# EAGLE design rpi900 (EAGLE 6.2)
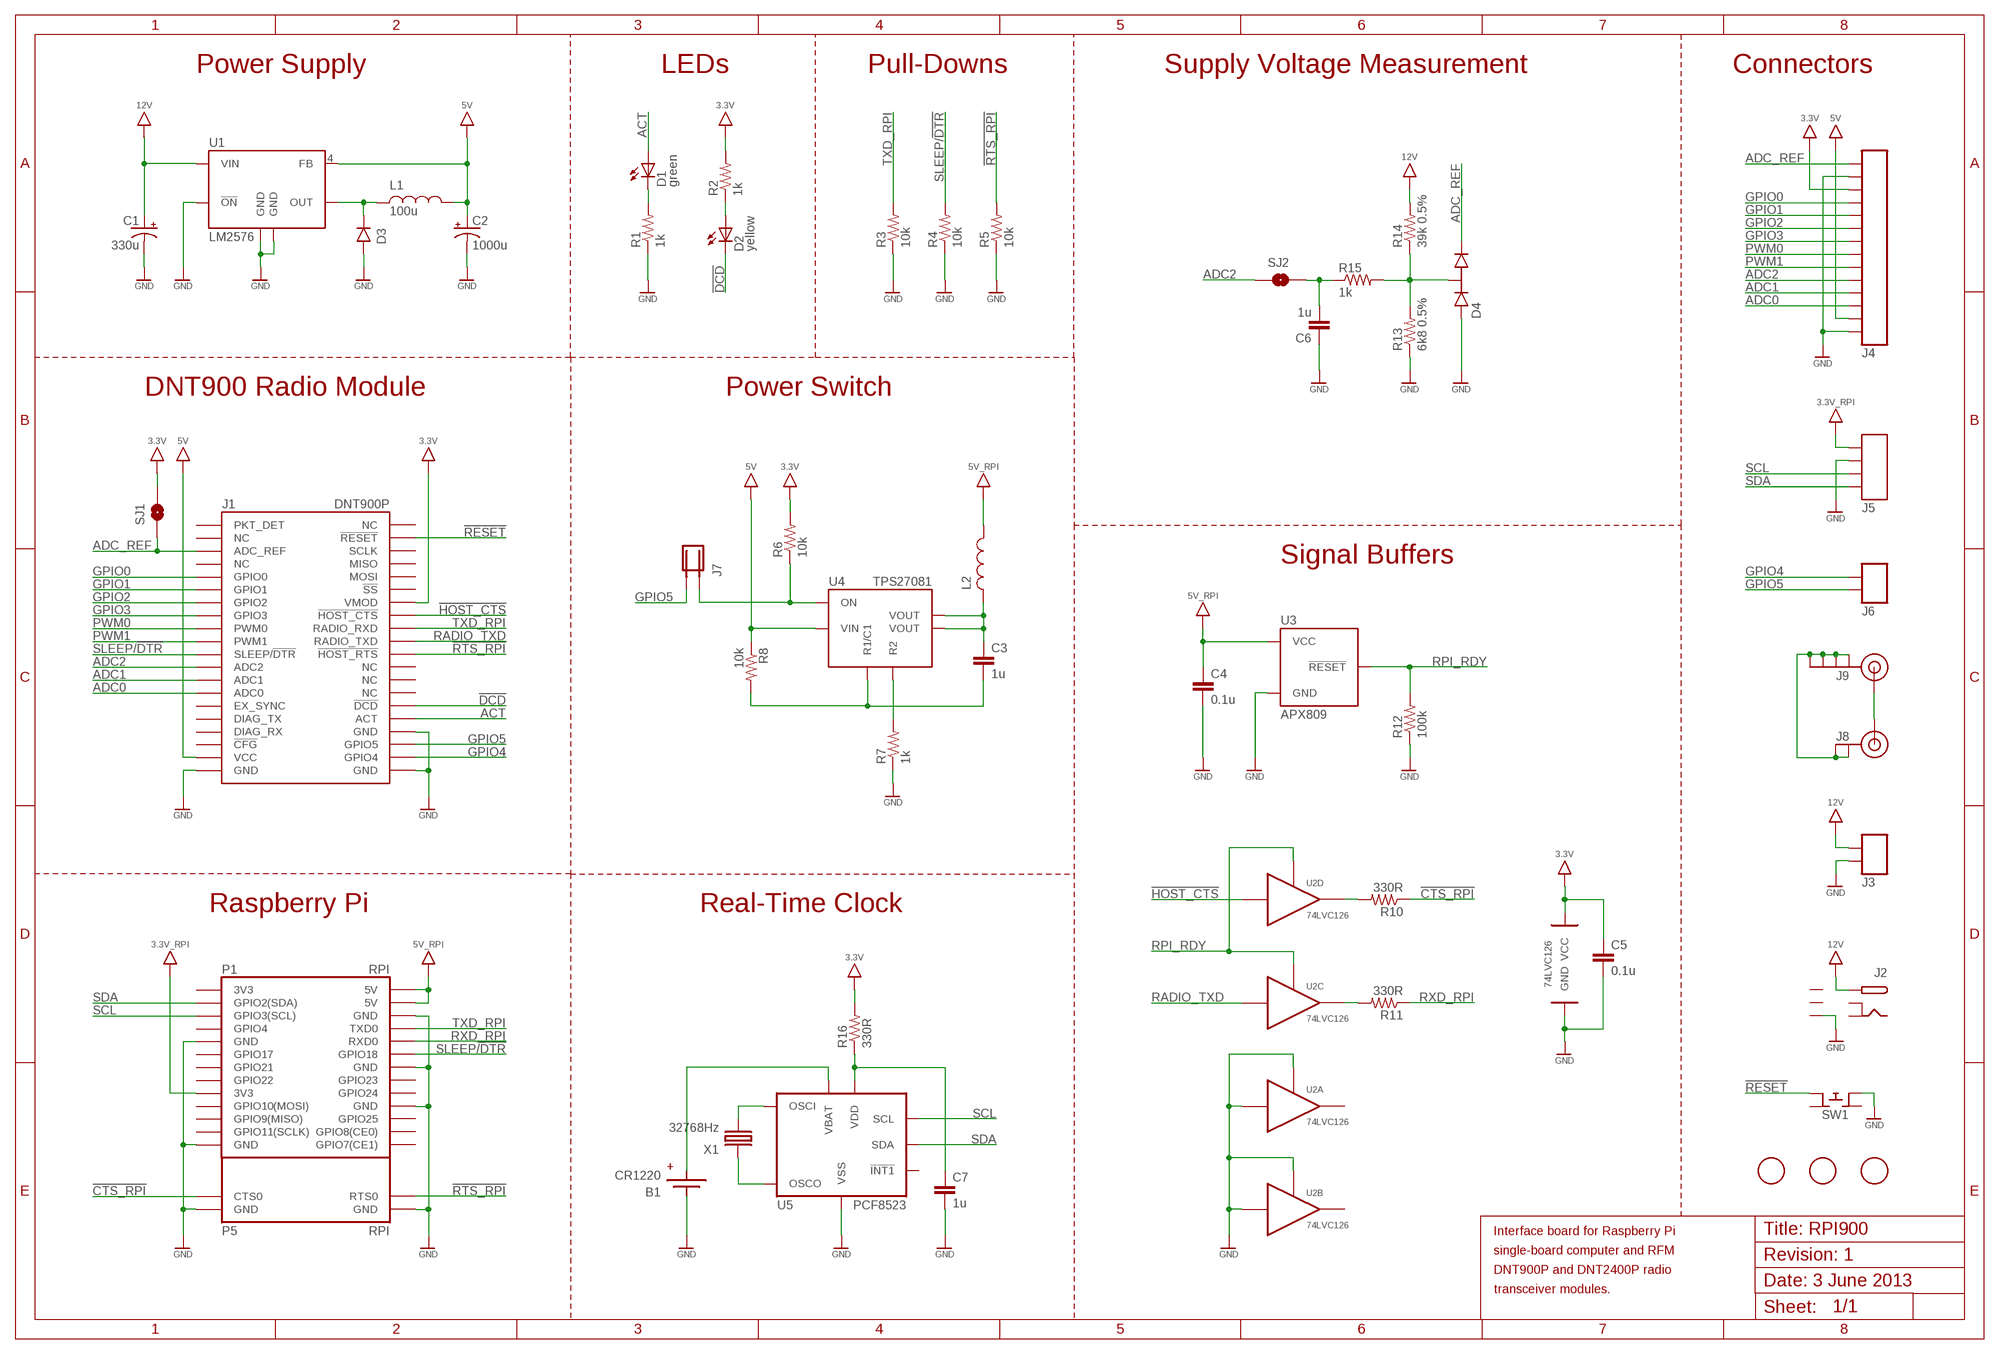
[diagram p0: schematic, sheet 1]

## Parts
B1  CR1220  CR1220SMDR  [3000]
C1  330u  CAP_POL-SMD  [140CLH-1010]
C2  1000u  CAP_POL-SMD  [140CLH-1010]
C3  1u  CAP  [0805]
C4  0.1u  CAP  [0805]
C5  0.1u  CAP  [0805]
C6  1u  CAP  [0805]
C7  1u  CAP  [0805]
D1  green  LTST-C171KGKT  [0805-LED]
D2  yellow  LTST-C171KGKT  [0805-LED]
D3  MURS320T3G  [DO-214AB]
D4  BAT54S  [SOT23]
F1  FIDUCIAL  [FIDUCIAL_1MM]
F2  FIDUCIAL  [FIDUCIAL_1MM]
F3  FIDUCIAL  [FIDUCIAL_1MM]
J1  DNT900P  [DNT900P]
J2  DCBARRELPTH  [PJ-002A]
J3  TERMINAL-2P-3.5MM  [TERMINAL-2P-3.5MM]
J4  TERMINAL-14P  [TERMINAL-14P-0.1]
J5  TERMINAL-4P  [TERMINAL-4P-0.1]
J6  TERMINAL-2P-0.1  [TERMINAL-2P-0.1]
J7  JUMPER  [JUMPER]
J8  U.FL  [U.FL]
J9  SMAPTH  [SMA-PTH]
L1  100u  SRR1280  [SRR1280]
L2  FERRITE-BEAD  [0805]
P  RPI  [RPI]
R1  1k  RESISTOR  [0805]
R2  1k  RESISTOR  [0805]
R3  10k  RESISTOR  [0805]
R4  10k  RESISTOR  [0805]
R5  10k  RESISTOR  [0805]
R6  10k  RESISTOR  [0805]
R7  1k  RESISTOR  [0805]
R8  10k  RESISTOR  [0805]
R10  330R  RESISTOR  [0805]
R11  330R  RESISTOR  [0805]
R12  100k  RESISTOR  [0805]
R13  6k8 0.5%  RESISTOR  [0805]
R14  39k 0.5%  RESISTOR  [0805]
R15  1k  RESISTOR  [0805]
R16  330R  RESISTOR  [0805]
SJ1  SOLDERJUMPERTRACE  [SJ_2S-TRACE]
SJ2  SOLDERJUMPERNO  [SJ_2S-NO]
SW1  FSM4JH  [JSM4JH]
U1  LM2576  [TO-263]
U2  74LVC126  [SO14]
U3  APX809  [SOT23]
U4  TPS27081  [TSOT-23-6]
U5  PCF8523  [SO08]
X1  32768Hz  XTAL6MM  [CFS-206]

## Nets
3.3V: C5.1 J1.P$34(VMOD) J4.3 R2.2 R6.2 R16.2 SJ1.2 U2.14(VCC)
3.3V_RPI: J5.1 P.P$17(1:3V3)
5V: C2.+ J1.P$19(VCC) J4.13 L1.P$2 R8.1 U1.4(FB) U4.P$4(VIN)
5V_RPI: C4.1 L2.2 P.P$2(1:5V) P.P$4(1:5V) U3.P$3(VCC)
12V: C1.+ J2.CENTRE J3.P$1 R14.2 U1.1(VIN)
!CTS_RPI: P.P$31(5:CTS0) R10.1
!DCD: D2.K(C) J1.P$26(!DCD)
!HOST_CTS: J1.P$33(!HOST_CTS) U2.12(D:X)
!RESET: J1.P$39(!RESET) SW1.P$3
!RTS_RPI: J1.P$30(!HOST_RTS) P.P$32(5:RTS0) R5.2
ACT: D1.A J1.P$25(ACT)
ADC0: J1.P$14(ADC0) J4.12
ADC1: J1.P$13(ADC1) J4.11
ADC2: J1.P$12(ADC2) J4.10 SJ2.1
ADC_REF: D4.P$2 J1.P$3(ADC_REF) J4.1 SJ1.1
EN_RPI: J7.1 R6.1 U4.P$5(ON)
GND: B1.NEGATIVE C1.- C2.- C4.2 C5.2 C6.1 C7.2 D3.A D4.P$1 J1.P$20(GND) J1.P$21(GND) J1.P$24(GND) J2.SLEEVE-BOTTOM J3.P$2 J4.2 J4.14 J5.2 P.P$6(1:GND) P.P$9(1:GND) P.P$14(1:GND) P.P$20(1:GND) P.P$25(1:GND) P.P$33(5:GND) P.P$34(5:GND) R1.1 R3.1 R4.1 R5.1 R7.1 R12.1 R13.1 SW1.P$1 U1.3(GND) U1.5(!ON) U1.TAB(GND) U2.1(A:!OE) U2.2(A:X) U2.4(B:!OE) U2.5(B:X) U2.7(GND) U3.P$1(GND) U5.4(VSS)
GPIO0: J1.P$5(GPIO0) J4.4
GPIO1: J1.P$6(GPIO1) J4.5
GPIO2: J1.P$7(GPIO2) J4.6
GPIO3: J1.P$8(GPIO3) J4.7
GPIO4: J1.P$22(GPIO4) J6.1
GPIO5: J1.P$23(GPIO5) J6.2 J7.2
N$1: D1.K(C) R1.2
N$2: D2.A R2.1
N$3: D4.P$3 R13.2 R14.1 R15.2
N$4: R10.2 U2.11(D:Y)
N$5: J8.P$3(SIGNAL) J9.SIG(SIGNAL)
N$6: R11.2 U2.8(C:Y)
N$7: C6.2 R15.1 SJ2.2
N$8: R7.2 U4.P$1(R2)
N$9: U5.1(OSCI) X1.P$2
N$10: J8.P$1(GND) J8.P$2(GND) J9.GND@0(GND) J9.GND@1(GND) J9.GND@2(GND) J9.GND@3(GND)
N$11: C7.1 R16.1 U5.8(VDD)
N$12: U5.2(OSCO) X1.P$1
OUT: D3.K L1.P$1 U1.2(OUT)
PWM0: J1.P$9(PWM0) J4.8
PWM1: J1.P$10(PWM1) J4.9
R1/C1: C3.2 R8.2 U4.P$6(R1/C1)
RADIO_TXD: J1.P$31(RADIO_TXD) U2.9(C:X)
RPI_RDY: R12.2 U2.10(C:!OE) U2.13(D:!OE) U3.P$2(!RESET)
RXD_RPI: P.P$10(1:RXD0) R11.1
SCL: J5.3 P.P$5(1:GPIO3(SCL)) U5.6(SCL)
SDA: J5.4 P.P$3(1:GPIO2(SDA)) U5.5(SDA)
SLEEP/!DTR: J1.P$11(SLEEP/!DTR) P.P$12(1:GPIO18) R4.2
TXD_RPI: J1.P$32(RADIO_RXD) P.P$8(1:TXD0) R3.2
VBAT: B1.POSITIVE1(POSITIVE) U5.3(VBAT)
VOUT: C3.1 L2.1 U4.P$2(VOUT) U4.P$3(VOUT)
Unconnected: J1.P$1(PKT_DET) J1.P$2(NC) J1.P$4(NC) J1.P$15(EX_SYNC) J1.P$16(DIAG_TX) J1.P$17(DIAG_RX) J1.P$18(!CFG) J1.P$27(NC) J1.P$28(NC) J1.P$29(NC) J1.P$35(!SS) J1.P$36(MOSI) J1.P$37(MISO) J1.P$38(SCLK) J1.P$40(NC) P.P$7(1:GPIO4) P.P$11(1:GPIO17) P.P$13(1:GPIO21) P.P$15(1:GPIO22) P.P$16(1:GPIO23) P.P$18(1:GPIO24) P.P$19(1:GPIO10(MOSI)) P.P$21(1:GPIO9(MISO)) P.P$22(1:GPIO25) P.P$23(1:GPIO11(SCLK)) P.P$24(1:GPIO8(CE0)) P.P$26(1:GPIO7(CE1)) SW1.P$2 SW1.P$4 U2.3(A:Y) U2.6(B:Y) U5.7(!INT1)

## Notes on the sheet
- Power Supply | LEDs | Pull-Downs | Supply Voltage Measurement | Connectors
- DNT900 Radio Module | Power Switch
- Signal Buffers
- Raspberry Pi | Real-Time Clock
- Interface board for Raspberry Pi | Title: RPI900
- single-board computer and RFM
- Revision: 1
- DNT900P and DNT2400P radio
- Date: 3 June 2013
- transceiver modules.

## Power pins joined to a net without a drawn wire
3V3: P.P$1(1:3V3)
CENTRE-BOTTOM: J2.CENTRE-BOTTOM
SHUNT: J2.SHUNT
SHUNT-BOTTOM: J2.SHUNT-BOTTOM
SLEEVE: J2.SLEEVE

## Library data of the parts
B1 = rpi900:CR1220
C1 C2 = rpi900:CAP_POL
C3-C7 = rpi900:CAP
D1 D2 = rpi900:LTST-C171KGKT
D3 = rpi900:MURS320T3G
D4 = rpi900:BAT54S
F1-F3 = rpi900:FIDUCIAL: For use by pick and place machines to calibrate the vision/machine, 1mm By microbuilder.eu
J1 = rpi900:DNT900P
J2 = rpi900:DCBARREL
J3 J6 = rpi900:TERMINAL-2P
J4 = rpi900:TERMINAL-14P
J5 = rpi900:TERMINAL-4P
J7 = rpi900:JUMPER
J8 = rpi900:U.FL: SMD antenna connector- WRL-09144
J9 = rpi900:SMA: SMA Antenna Connector End launch SMA connector. The paste layer has been removed so that the connector can be hand soldered onto the board after reflow.
L1 = rpi900:SRR1280
L2 = rpi900:FERRITE-BEAD
P = rpi900:RPI
R1-R8 R10-R16 = rpi900:RESISTOR
SJ1 SJ2 = rpi900:SOLDERJUMPER: Solder Jumper Standard SMD solder jumper. Used to automate production. Two varients : Normally Open and Normally Closed are the same, but have different paste layers. NC will have a large amount of paste and should jumper during reflow.
SW1 = rpi900:FSM4J
U1 = rpi900:LM2576
U2 = rpi900:74LVC126
U3 = rpi900:APX809
U4 = rpi900:TPS27081
U5 = rpi900:PCF8523
X1 = rpi900:XTAL

## Board
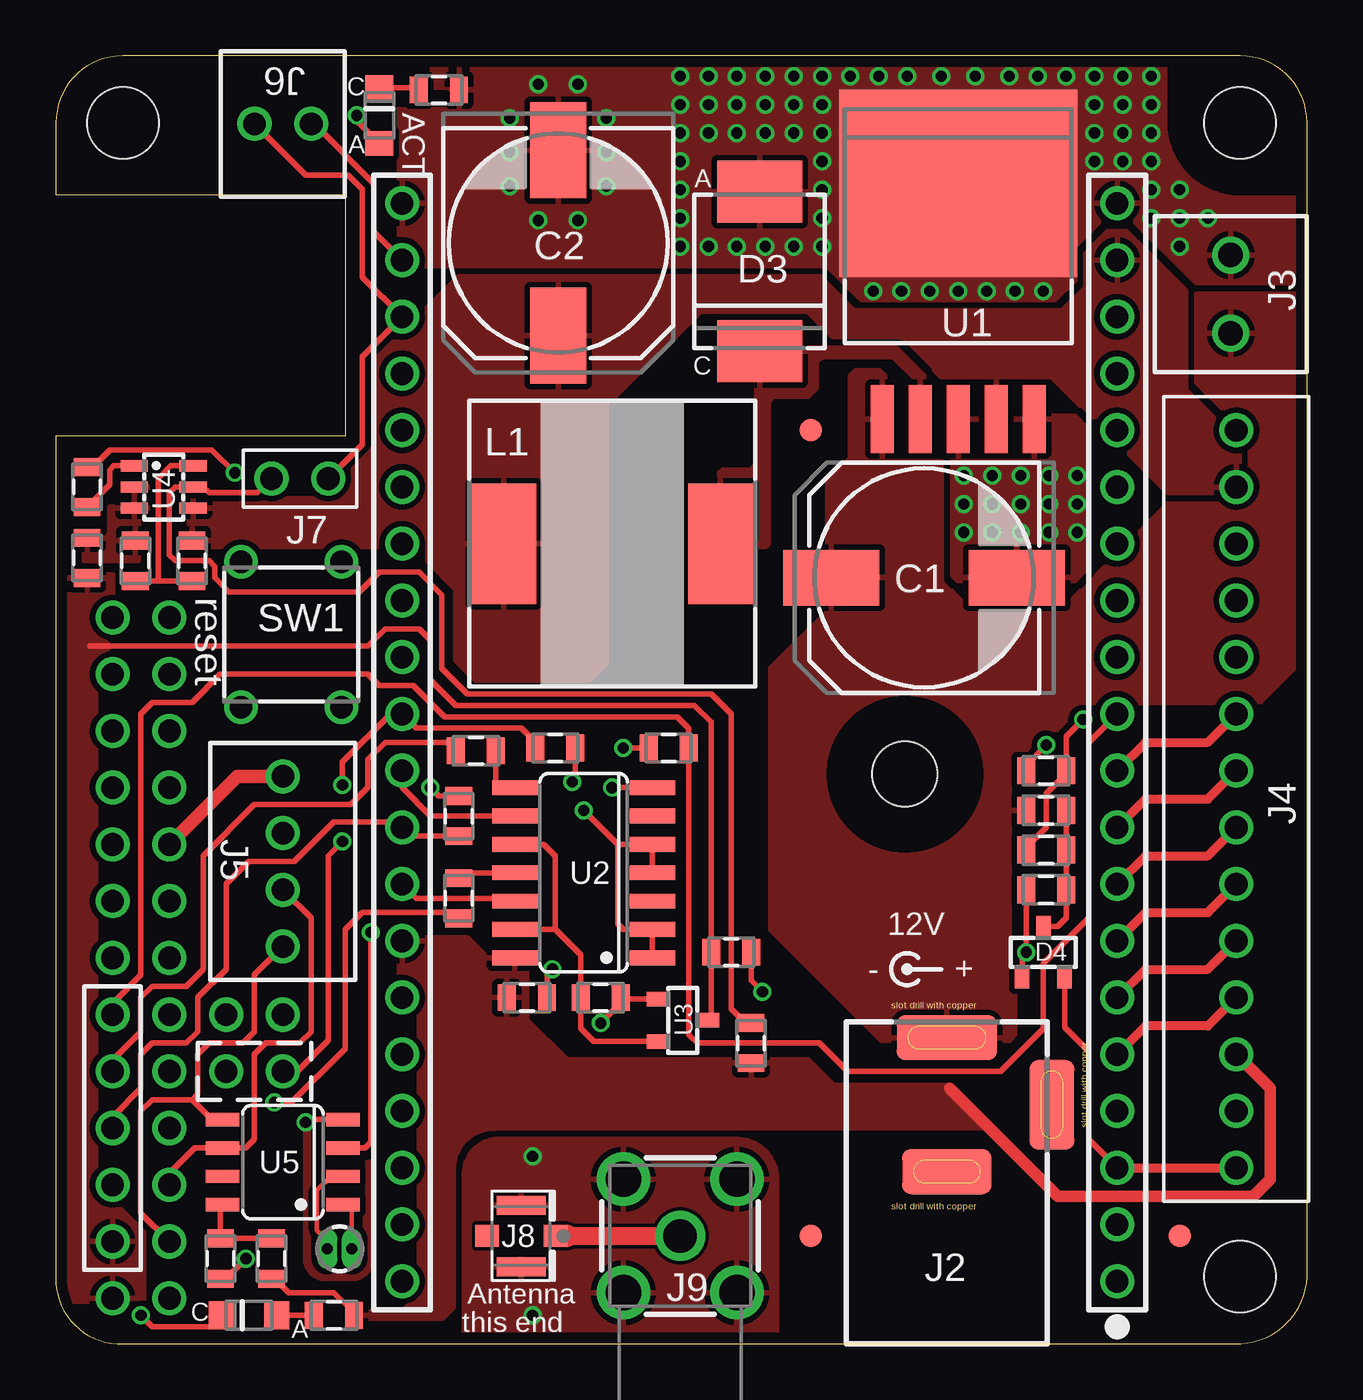
[diagram p1: board, top side]
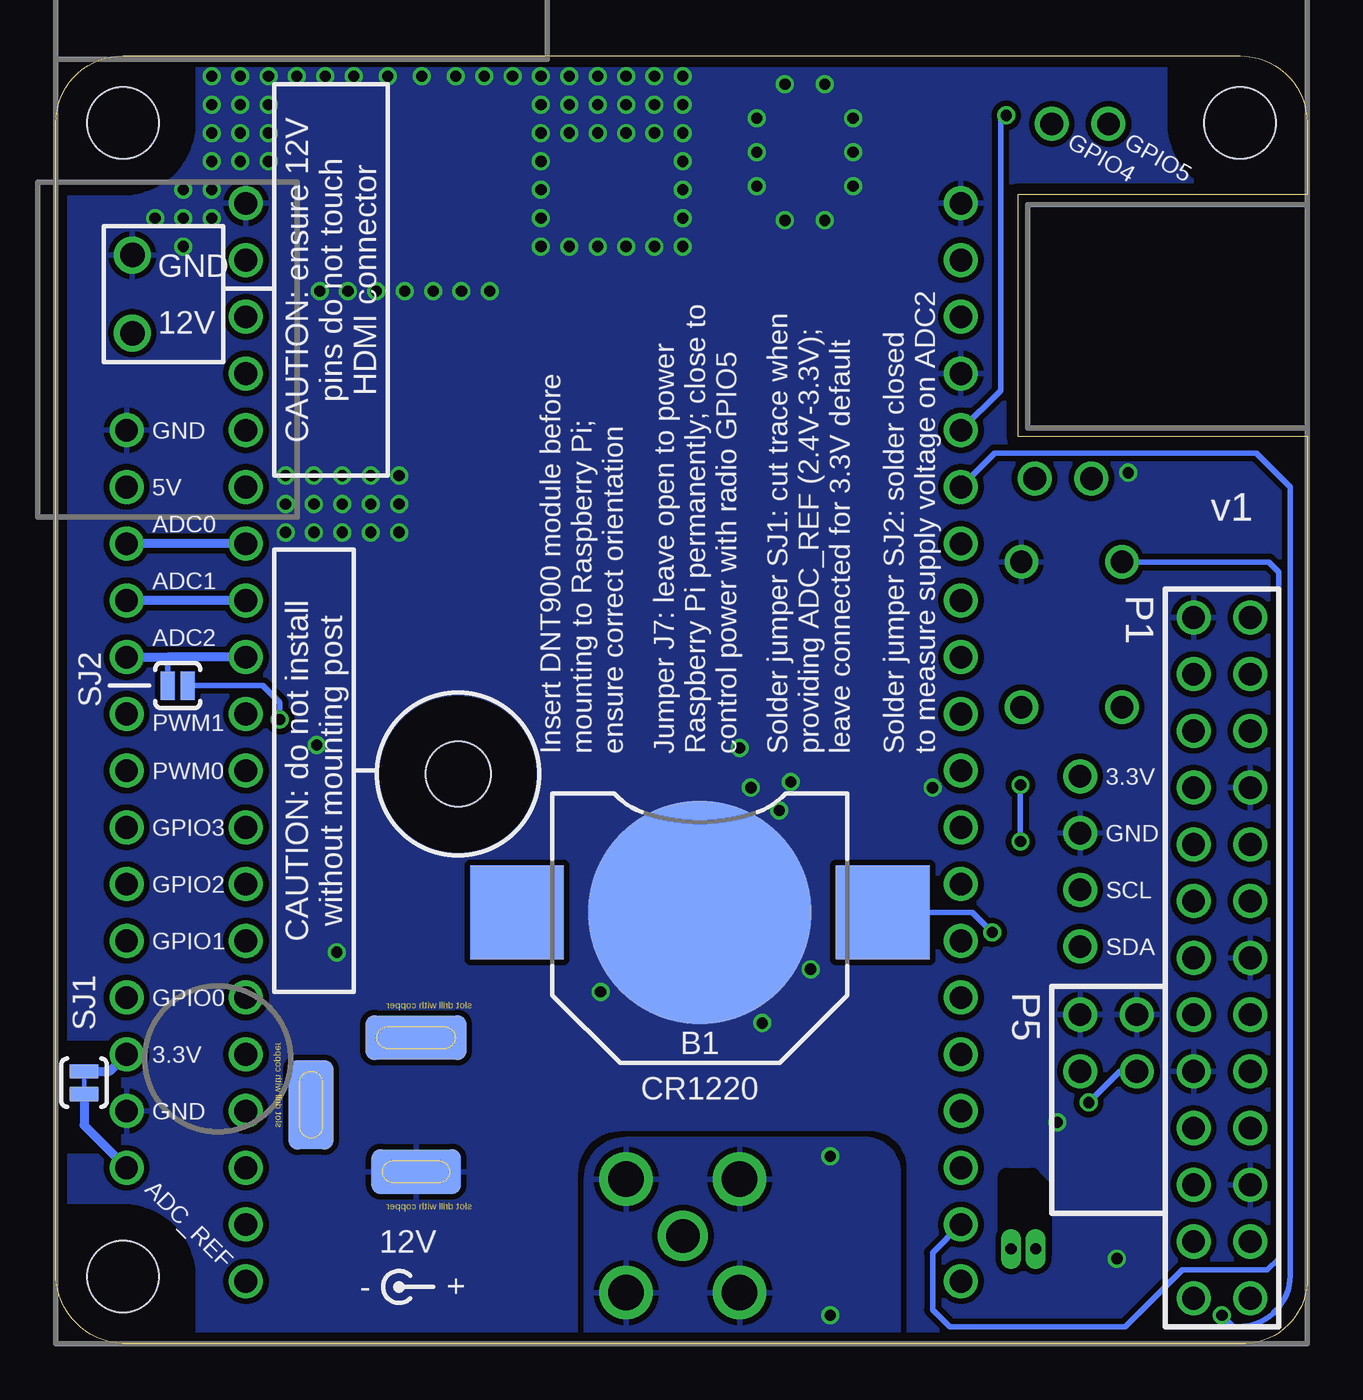
[diagram p2: board, bottom side, seen from below]

Size 56 x 57.66 mm. Coordinates in mm from the lower left corner, seen from the top.
Outline: 2.75,0 52.75,0 arc90 56,3 56,54.66 arc90 53,57.66 3,57.66 arc90 0,54.66 0,51.44 12.95,51.44 12.95,40.64 0,40.64 0,3.05 0,3 arc90 2.75,0
Copper layers (1*16): Top 0.035mm / dielectric 1.5mm / Bottom 0.035mm
Design rules: minimum track width 6mil, minimum drill 12mil, track to track 6mil, track to pad 10mil, pad to pad 8mil, via to via 10mil, smd to smd 0mil, copper to edge 20mil, drill to drill 10mil, minimum pad ring 6mil, minimum via ring 6mil, stop-mask expansion 2mil, vias tented up to drill 100mil, thermal gap 10mil
tRestrict: 6 lines
bRestrict: area 11.8,3.9 to 13.5,7.5; 6 lines

### Footprints (pad centres in the part's own frame; a part is rotated, then mirrored left to right if it is on the bottom)
3000 = smd 10 x 10: NEGATIVE 0,0 | smd 4.2 x 4.2: POSITIVE1 8.185,0; POSITIVE2 -8.185,0
140CLH-1010 = smd 4.3 x 2.5: + -4.15,0; - 4.15,0
0805 = smd 0.8 x 1.2: 1 -0.9,0; 2 0.9,0
0805-LED = smd 1.1 x 1.25: A 1.25,0; K -1.25,0
DO-214AB = smd 2.794 x 3.81: A 3.569,0; K -3.569,0
SOT23 = smd 0.95 x 0.65: P$1 -1.15,0.95; P$2 -1.15,-0.95; P$3 1.15,0
FIDUCIAL_1MM = smd 1 x 1: 1 0,0
DNT900P = drill 1.016: P$1 0,0; P$2 0,-2.54; P$3 0,-5.08; P$4 0,-7.62; P$5 0,-10.16; P$6 0,-12.7; P$7 0,-15.24; P$8 0,-17.78; P$9 0,-20.32; P$10 0,-22.86; P$11 0,-25.4; P$12 0,-27.94; P$13 0,-30.48; P$14 0,-33.02; P$15 0,-35.56; P$16 0,-38.1; P$17 0,-40.64; P$18 0,-43.18; P$19 0,-45.72; P$20 0,-48.26; P$21 32.004,-48.26; P$22 32.004,-45.72; P$23 32.004,-43.18; P$24 32.004,-40.64; P$25 32.004,-38.1; P$26 32.004,-35.56; P$27 32.004,-33.02; P$28 32.004,-30.48; P$29 32.004,-27.94; P$30 32.004,-25.4; P$31 32.004,-22.86; P$32 32.004,-20.32; P$33 32.004,-17.78; P$34 32.004,-15.24; P$35 32.004,-12.7; P$36 32.004,-10.16; P$37 32.004,-7.62; P$38 32.004,-5.08; P$39 32.004,-2.54; P$40 32.004,0
PJ-002A = smd 4.5 x 2: CENTRE 0,13.7 | smd 4.5 x 2 bottom: CENTRE-BOTTOM 0,13.7 | smd 2 x 4: SHUNT 4.7,10.7 | smd 2 x 4 bottom: SHUNT-BOTTOM 4.7,10.7 | smd 4 x 2: SLEEVE 0,7.7 | smd 4 x 2 bottom: SLEEVE-BOTTOM 0,7.7
TERMINAL-2P-3.5MM = drill 1.1: P$1 1.75,0; P$2 -1.75,0
TERMINAL-14P-0.1 = drill 1.016: 1 0,0; 2 2.54,0; 3 5.08,0; 4 7.62,0; 5 10.16,0; 6 12.7,0; 7 15.24,0; 8 17.78,0; 9 20.32,0; 10 22.86,0; 11 25.4,0; 12 27.94,0; 13 30.48,0; 14 33.02,0
TERMINAL-4P-0.1 = drill 1.016: 1 0,0; 2 2.54,0; 3 5.08,0; 4 7.62,0
TERMINAL-2P-0.1 = drill 1.016: 1 0,0; 2 2.54,0
JUMPER = drill 1.016: 1 0,0; 2 2.54,0
U.FL = smd 2.2 x 0.85: P$1 0,1.375; P$2 0,-1.375 | smd 1.05 x 1: P$3 1.525,0; P$4 -1.525,0
SMA-PTH = drill 1.6: GND@0 -2.54,2.54; GND@1 2.54,2.54; GND@2 2.54,-2.54; GND@3 -2.54,-2.54 | drill 1.5: SIG 0,0
SRR1280 = smd 2.9 x 5.4: P$1 -4.85,0; P$2 4.85,0
RPI = drill 1.016: P$1 5.08,2.032; P$2 2.54,2.032; P$3 5.08,4.572; P$4 2.54,4.572; P$5 5.08,7.112; P$6 2.54,7.112; P$7 5.08,9.652; P$8 2.54,9.652; P$9 5.08,12.192; P$10 2.54,12.192; P$11 5.08,14.732; P$12 2.54,14.732; P$13 5.08,17.272; P$14 2.54,17.272; P$15 5.08,19.812; P$16 2.54,19.812; P$17 5.08,22.352; P$18 2.54,22.352; P$19 5.08,24.892; P$20 2.54,24.892; P$21 5.08,27.432; P$22 2.54,27.432; P$23 5.08,29.972; P$24 2.54,29.972; P$25 5.08,32.512; P$26 2.54,32.512; P$31 7.62,12.192; P$32 10.16,12.192; P$33 7.62,14.732; P$34 10.16,14.732 | hole 2.9: 38,25.5
SJ_2S-TRACE = smd 0.635 x 1.27: 1 -0.508,0; 2 0.508,0
SJ_2S-NO = smd 0.635 x 1.27: 1 -0.45,0; 2 0.45,0
JSM4JH = drill 1: P$1 -3.25,2.25; P$2 3.25,2.25; P$3 -3.25,-2.25; P$4 3.25,-2.25
TO-263 = smd 3.048 x 1.016: 1 -8.636,3.404; 2 -8.636,1.702; 3 -8.636,0; 4 -8.636,-1.702; 5 -8.636,-3.404 | smd 8.382 x 10.668: TAB 1.905,0
SO14 = smd 2.032 x 0.66: 1 -3.073,3.81; 2 -3.073,2.54; 3 -3.073,1.27; 4 -3.073,0; 5 -3.073,-1.27; 6 -3.073,-2.54; 7 -3.073,-3.81; 8 3.073,-3.81; 9 3.073,-2.54; 10 3.073,-1.27; 11 3.073,0; 12 3.073,1.27; 13 3.073,2.54; 14 3.073,3.81
TSOT-23-6 = smd 1.22 x 0.5: P$1 -1.315,0.95; P$2 -1.315,0; P$3 -1.315,-0.95; P$4 1.315,-0.95; P$5 1.315,0; P$6 1.315,0.95
SO08 = smd 1.5 x 0.6: 1 -2.7,1.905; 2 -2.7,0.635; 3 -2.7,-0.635; 4 -2.7,-1.905; 5 2.7,-1.905; 6 2.7,-0.635; 7 2.7,0.635; 8 2.7,1.905
CORNER-SHARP = hole 3.2: 3,3
CFS-206 = drill 0.5 pad 0.897 long: P$1 -0.55,0; P$2 0.55,0

### Placement (x,y rotation side)
B1  27.18,19.3 0 bottom
C1  38.86,34.29 0 top
C2  22.48,49.28 90 top
C3  3.56,35.05 270 top
C4  30.23,17.53 0 top
C5  21.08,15.49 0 top
C6  44.32,25.65 0 top
C7  7.37,3.81 270 top
D1  14.48,54.99 270 top
D2  8.64,1.27 0 top
D3  31.5,48.01 90 top
D4  44.2,17.53 90 top
F1  33.78,4.83 0 top
F2  50.29,4.83 0 top
F3  33.78,40.89 0 top
J1  47.5,2.79 180 top
J2  39.88,0 0 top
J3  52.58,46.99 270 top
J4  52.83,7.87 90 top
J5  10.16,25.4 270 top
J6  11.43,54.61 180 top
J7  9.65,38.73 0 top
J8  20.83,4.83 0 top
J9  27.94,4.83 180 top
L1  24.89,35.81 180 top
L2  1.4,35.18 270 top
P  0,0 0 top
R1  17.14,56.13 180 top
R2  12.45,1.27 0 top
R3  18.03,23.62 270 top
R4  27.43,26.67 0 top
R5  22.35,26.67 180 top
R6  31.11,13.46 270 top
R7  1.4,38.35 270 top
R8  6.1,35.05 270 top
R10  18.03,19.94 90 top
R11  18.8,26.54 0 top
R12  24.38,15.49 180 top
R13  44.32,20.32 0 top
R14  44.32,23.88 180 top
R15  44.32,22.1 0 top
R16  9.65,3.81 270 top
SJ1  54.74,11.68 90 bottom
SJ2  50.55,29.46 0 bottom
SW1  10.54,31.75 270 top
U1  40.39,50.04 90 top
U2  23.62,21.08 180 top
U3  28.07,14.48 0 top
U4  4.83,38.35 0 top
U5  10.16,8.13 180 top
U$9  [CORNER-SHARP]  0,57.66 270 top
U$28  [CORNER-SHARP]  56,57.66 180 top
U$46  [CORNER-SHARP]  56,0 90 top
X1  12.7,4.24 0 top

### Tracks (layer width: path | path; a pad name or v marks a point on that pad's centre or on a via)
3.3V
  Top 0.254: R2.2 13.35,1.39 12.45,2.29 10.41,2.29 9.79,2.91 R16.2
  Top 0.508: J4.3 54.36,11.43 54.36,7.37 53.59,6.6 46.23,6.6 44.83,6.6 40.01,11.43
  Bottom 0.406: SJ1.2 53.59,12.19 J4.3
  pour Top (isolate 0.254, rank 3): 19.81,9.65 41.91,9.65 40.01,11.56 34.8,11.56 33.66,12.7 22.86,12.7 21.08,14.48 21.08,17.4 19.18,17.4 18.41,18.16 15.37,18.16 15.37,15.88 16.26,14.99 16.26,2.16 16.26,2.16 15.49,1.4 13.21,1.4 13.21,1.14 17.27,1.14 17.78,1.65 17.78,7.62 arc-90
3.3V_RPI
  Top 0.61: P.P$17 8.13,25.4 J5.1
5V
  pour Top (isolate 0.254, rank 4): 12.95,42.67 12.95,37.85 5.97,37.85 5.97,35.69 16.64,35.69 16.64,35.05 17.91,33.78 17.91,30.61 18.8,29.72 23.88,29.72 24.64,30.48 24.64,42.04 28.83,46.23 33.66,46.23 34.8,45.09 37.85,45.09 39.62,43.31 41.91,43.31 41.91,42.42 42.42,42.42 42.42,43.31 44.58,43.31 49.78,38.1 52.96,38.1 52.96,49.78 20.07,49.78
5V_RPI
  Top 0.254: 1.52,31.24 13.97,31.24 14.73,32 16.26,32 16.76,31.5 16.76,29.72 17.91,28.57 28.57,28.57 29.33,27.82 C4.1 29.33,14.48 U3.P$3
  pour Top (isolate 0.254, rank 4): 0,1.91 0,34.42 2.54,34.42 2.54,33.53 1.78,32.77 1.78,31.88 2.41,31.24 1.78,30.61 1.78,7.11 3.94,4.95 3.94,1.91
  pour Top (isolate 0.254): 2.54,34.42 2.54,33.4 0.64,33.4 0.64,34.42
12V
  pour Top (isolate 0.254, rank 3): 36.96,13.59 32,18.54 32,30.23 34.54,32.77 34.54,38.61 35.56,39.62 35.56,43.31 35.81,43.56 36.83,43.56 37.21,43.18 37.21,39.62 39.62,39.62 39.62,34.16 40.64,33.15 45.34,33.15 49.78,37.59 53.47,37.59 53.47,40.64 51.05,43.05 51.05,46.99 56.13,46.99 56.13,30.99 53.85,28.7 45.97,28.7 42.67,25.4 42.67,24.13 43.43,24.13 43.43,23.62 42.67,23.62 42.67,15.75 42.93,15.75 42.93,13.84 42.67,13.59
!CTS_RPI  (via drill 0.5)
  Top 0.254: R10.1 17.77,19.3 13.72,19.3 12.95,18.54 12.95,13.21 10.54,10.79 v9.78,10.79
  Bottom 0.254: v9.78,10.79 8.38,12.19 P.P$31
!DCD  (via drill 0.5)
  Top 0.254: v3.81,1.27 4.32,0.76 7.39,0.76 D2.K 7.37,1.27
  Bottom 0.254: J1.P$26 13.97,39.88 2.29,39.88 0.76,38.35 0.76,3.05 arc90 3.05,0.76 3.3,0.76 v3.81,1.27
!HOST_CTS
  Top 0.254: U2.12 20.42,19.94 16.13,19.94 J1.P$33
!RESET
  Bottom 0.254: J1.P$39 16.76,4.06 16.76,1.52 16,0.76 8.13,0.76 5.59,3.3 1.78,3.3 1.27,3.81 1.27,34.54 1.73,35 SW1.P$3
!RTS_RPI  (via drill 0.5)
  Top 0.254: R5.2 21.45,26.93 20.83,27.56 16.13,27.56 J1.P$30 14.99,28.19 12.83,26.04 v12.83,25.02 | P.P$32 10.79,12.19 12.19,13.59 12.19,21.84 v12.83,22.48
  Bottom 0.254: v12.83,25.02 v12.83,22.48
ACT  (via drill 0.5)
  Top 0.254: D1.A 13.46,54.76 v13.46,54.99
  Bottom 0.254: J1.P$25 13.72,42.67 13.72,54.74 v13.46,54.99
ADC0
  Bottom 0.406: J1.P$14 J4.12
ADC1
  Bottom 0.406: J1.P$13 J4.11
ADC2
  Bottom 0.254: SJ2.1 51,30.73
  Bottom 0.406: J1.P$12 51,30.73 J4.10
ADC_REF
  Top 0.254: D4.P$2 45.15,14.16 46.23,13.08 46.23,9.14 J1.P$3
  Top 0.406: J1.P$3 J4.1
  Bottom 0.406: SJ1.1 54.74,9.78 J4.1
EN_RPI
  Top 0.254: J7.1 9.02,38.1 6.86,38.1 6.6,38.35 U4.P$5 5.33,38.35 5.08,38.1 5.08,35.31 5.33,35.05 6.86,35.05 7.11,34.8 7.11,34.29 7.75,33.66 13.59,33.66 14.48,34.54 16.26,34.54 17.27,33.53 17.27,30.23 18.41,29.08 29.34,29.08 30.23,28.19 30.23,14.99 30.85,14.36 R6.1
GND  (via drill 0.5)
  Top 0.254: U2.4 U2.5 25.15,22.35 | U2.1 U2.2 25.4,18.54 25.15,18.8 25.15,22.35 | R7.1 1.66,39.25 2.41,40.01 6.99,40.01 v8,38.99 | C5.2 21.98,16.52 v22.23,16.76 | U2.7 v24.89,24.89 | C4.2 31.11,17.52 31.11,16.26 v31.62,15.75 | R12.1 | U3.P$1 25.35,15.43 R12.1 | R5.1 23.25,25.28 v23.11,25.15 | R4.1 v25.4,26.67 | R3.1 17.13,24.52 v16.76,24.89 | 25.15,22.35 v23.62,23.88 | R12.1 25.28,15.25 v24.38,14.35 | U5.4 11.3,10.03 v11.18,9.91 | D4.P$1 43.25,17.34 v43.43,17.53 v43.42,17.54 R13.1 | C6.1 43.42,25.9 v44.32,26.8 | C7.2 7.61,2.91 v8.51,3.81
  other vias: 40.64,38.86 40.64,37.59 41.91,37.59 43.18,37.59 44.45,37.59 43.18,38.86 41.91,38.86 50.29,49.12 50.29,50.39 49.02,50.39 49.02,51.66 50.29,51.66 49.02,52.93 47.75,52.93 46.48,52.93 46.48,54.2 47.75,54.2 49.02,54.2 49.02,55.47 49.02,56.74 47.75,56.74 47.75,55.47 46.48,55.47 46.48,56.74 45.21,56.74 43.94,56.74 42.67,56.74 41.15,56.74 39.62,56.74 38.1,56.74 36.83,56.74 35.56,56.74 34.29,49.12 34.29,50.39 34.29,51.66 34.29,52.93 34.29,54.2 34.29,55.47 34.29,56.74 33.02,56.74 33.02,55.47 33.02,54.2 31.75,54.2 30.48,54.2 29.21,54.2 29.21,55.47 29.21,56.74 30.48,56.74 31.75,56.74 31.75,55.47 30.48,55.47 20.32,54.86 24.64,54.86 24.64,53.34 24.64,51.82 20.32,53.34 20.32,51.82 33.02,49.12 31.75,49.12 30.48,49.12 29.21,49.12 23.37,50.29 21.59,50.29 51.56,50.39 27.94,54.2 27.94,52.93 27.94,51.66 27.94,50.39 27.94,49.12 36.58,47.12 37.85,47.12 40.64,36.32 41.91,36.32 43.18,36.32 44.45,36.32 45.72,36.32 23.37,56.39 21.59,56.39 27.94,55.47 27.94,56.74 39.12,47.12 40.39,47.12 41.66,47.12 42.93,47.12 44.2,47.12 44.45,38.86 45.72,37.59 45.72,38.86
  pour Bottom (isolate 0.254, rank 6): 0,0 0,57.66 56.13,57.66 56.13,0
  pour Top (isolate 0.254, rank 2): 40.13,41.53 45.59,41.53 46.1,41.02 46.1,34.67 45.59,34.16 40.39,34.16 40.13,34.42
  pour Top (isolate 0.254, rank 2): 56.13,47.5 56.13,57.66 12.95,57.66 12.95,48.26 34.54,48.26 36.07,46.74 44.7,46.74 45.59,47.62 45.59,49.15 46.99,50.55 48.01,50.55 51.05,47.5
  pour Top (isolate 0.254): 11.3,9.91 11.3,3.81 13.84,3.81 13.84,6.1 13.97,6.1 13.97,8.13 14.1,8.13 14.1,3.81 arc-90 13.34,2.92 12.06,2.92 arc-90 11.18,3.81 11.18,9.91
GPIO0
  Top 0.406: J1.P$5 48.77,14.22 51.56,14.22 J4.4
GPIO1
  Top 0.406: J4.5 51.56,16.76 48.77,16.76 J1.P$6
GPIO2
  Top 0.406: J4.6 51.56,19.3 48.77,19.3 J1.P$7
GPIO3
  Top 0.406: J4.7 51.56,21.84 48.77,21.84 J1.P$8
GPIO4
  Top 0.254: J1.P$22 14.22,49.78 14.22,51.94 11.56,54.61 J6.1
GPIO5
  Top 0.254: J6.2 11.18,52.32 13.08,52.32 13.72,51.69 13.72,47.75 J1.P$23 13.72,44.2 13.72,40.26 J7.2
N$1
  Top 0.254: D1.K 16.14,56.24 R1.2
N$2
  Top 0.254: D2.A R2.1
N$3
  Top 0.254: R14.1 R15.2 R13.2 45.22,19.06 45.21,19.05 44.84,18.68 D4.P$3
N$4
  Top 0.254: R10.2 18.28,21.08 U2.11
N$5
  Top 0.813: 22.86,4.83 J9.SIG
  Top 1.001: J8.P$3 22.86,4.83
N$6
  Top 0.254: U2.8 19.7,24.89 R11.2
N$7  (via drill 0.5)
  Top 0.254: v45.97,27.94 45.22,27.19 C6.2 45.22,25.54 44.32,24.64 44.32,23.11 43.42,22.21 R15.1
  Bottom 0.254: v45.97,27.94 45.97,28.7 46.74,29.46 SJ2.2
N$8
  Top 0.254: U4.P$1 2.6,39.3 2.41,39.12 2.41,38.47 R7.2
N$9
  Top 0.203: U5.1 13.25,6.22 X1.P$2
N$10  (via drill 0.5)
  other vias: 21.34,1.27 21.34,8.38
  pour Top (isolate 0.152): 18.29,0 18.29,7.62 arc-90 19.81,9.14 30.48,9.14 arc-90 32.26,7.37 32.26,0
  pour Bottom (isolate 0.254): 18.29,0 18.29,7.62 arc-90 19.81,9.14 30.48,9.14 arc-90 32.26,7.37 32.26,0
N$11
  Top 0.254: R16.1 C7.1 7.37,6.22 U5.8
N$12
  Top 0.203: U5.2 12.32,7.49 11.68,6.86 11.68,5.08 12.15,4.61 X1.P$1
OUT
  pour Top (isolate 0.254, rank 2): 31.75,35.69 31.88,35.81 31.88,42.16 32.13,42.42 33.66,42.42 34.04,42.8 34.04,43.94 34.29,44.2 37.47,44.2 38.48,43.18 38.48,42.42 38.86,42.42 38.86,43.31 37.59,44.58 31.37,44.58 31.37,39.37 31.11,39.12 29.84,39.12 29.72,38.99 29.72,35.69
PWM0
  Top 0.406: J4.8 51.56,24.38 48.77,24.38 J1.P$9
PWM1
  Top 0.406: J4.9 51.56,26.92 48.77,26.92 J1.P$10
R1/C1
  Top 0.254: U4.P$6 5.14,39.3 4.57,38.73 | 3.57,34.16 C3.2 4.57,34.15 | 4.57,38.73 4.57,34.15 | 4.57,34.15 R8.2 | 4.57,38.73 4.57,34.15
RADIO_TXD
  Top 0.254: U2.9 16.76,23.62 15.49,24.89 J1.P$31
RPI_RDY
  Top 0.254: U2.10 21.84,22.35 22.35,21.84 22.35,18.54 | U2.13 22.35,18.54 | 22.35,18.54 23.48,17.41 R12.2 23.48,14.11 24.06,13.53 U3.P$2
RXD_RPI
  Top 0.254: P.P$10 2.54,12.7 3.81,13.97 3.81,15.49 4.32,16 5.84,16 6.6,16.76 6.6,21.84 8.89,24.13 13.21,24.13 13.97,24.89 13.97,26.16 14.73,26.92 17.9,26.92 R11.1
SCL
  Top 0.254: J5.3 11.43,19.05 11.43,13.97 10.92,13.46 9.4,13.46 8.89,12.95 8.89,9.14 8.51,8.76 U5.6 6.22,8.76 5.08,7.62 P.P$5
SDA
  Top 0.254: P.P$3 3.81,5.84 3.81,8.38 3.81,10.41 4.32,10.92 6.1,10.92 | 6.1,10.92 6.35,11.18 6.35,12.95 6.86,13.46 8.38,13.46 8.89,13.97 8.89,16.51 J5.4 | U5.5 6.99,10.03 6.1,10.92
SLEEP/!DTR
  Top 0.254: J1.P$11 46.23,26.92 46.23,19.05 44.2,17.02 44.2,14.1 42.29,12.19 35.43,12.19 34.16,13.46 28.7,13.46 28.33,13.83 R4.2 28.33,27.55 27.81,28.07 17.4,28.07 16,29.46 14.48,29.46 13.97,29.97 7.37,29.97 6.1,28.7 4.32,28.7 3.81,28.19 3.81,16.51 2.54,15.24 P.P$12
TXD_RPI
  Top 0.254: R3.2 15.89,22.72 J1.P$32 15.24,23.37 12.45,23.37 10.67,21.59 8.64,21.59 7.62,20.57 7.62,16.76 6.35,15.49 6.35,13.97 5.84,13.46 4.32,13.46 3.81,12.95 3.81,11.43 2.54,10.16 P.P$8
VBAT  (via drill 0.5)
  Top 0.254: U5.3 13.84,8.76 14.1,9.02 v14.1,18.41
  Bottom 0.254: B1.POSITIVE1 14.99,19.3 v14.1,18.41
VOUT
  pour Top (isolate 0.254, rank 3): 1.27,35.05 1.27,36.2 2.41,36.2 2.41,37.47 3.05,37.47 3.05,38.35 4.57,38.35 4.57,37.34 3.68,37.34 3.68,35.05

### Text on the board
tPlace: C | ACT | A | A | C | reset | 12V | - | + | Antenna | C | this end | A
bPlace: GPIO5 | GPIO4 | HDMI connector | pins do not touch | CAUTION: ensure 12V | GND | 12V | GND | 5V | v1 | ADC0 | P1 | ADC1 | ADC2 | PWM1 | to measure supply voltage on ADC2 | Solder jumper SJ2: solder closed | leave connected for 3.3V default | providing ADC_REF (2.4V-3.3V); | Solder jumper SJ1: cut trace when | control power with radio GPIO5 | Raspberry Pi permanently; close to | Jumper J7: leave open to power | ensure correct orientation | mounting to Raspberry Pi; | Insert DNT900 module before | without mounting post | CAUTION: do not install | 3.3V | PWM0 | GPIO3 | GND | SCL | GPIO2 | GPIO1 | SDA | P5 | GPIO0 | 3.3V | GND | ADC_REF | 12V | + | -
tDocu: Headers J1A and J1B support daughter card; | components between headers are height-limited | to less than 11mm. | SMA connector J9 projects over edge of PCB. | Connectors J3, J4, J5 and J6 are not installed. | No assembly on bottom of board (bottom headers | P1 and P5 and battery B1 are not installed). | Peelable solder mask protects bottom pads of | P1, P5, J3, J4, J5, J6 and B1. | Position of pin 1 on ICs indicated with a dot. | Diode and capacitor polarities are indicated by | a bar on cathode. | Please note: connector J8 is not symmetrical; | ensure signal pin is located as marked. | Mount crystal X1 vertically; do not force. | Secure to PCB or side of J1A using adhesive if | you advise. Observe handling and soldering | precautions as indicated on Citizen website. | F1, F2 and F3 are 1mm fiducial markers. | J1A | J1B